# EAGLE design mayfly_platform_revb (EAGLE 7.7.0)
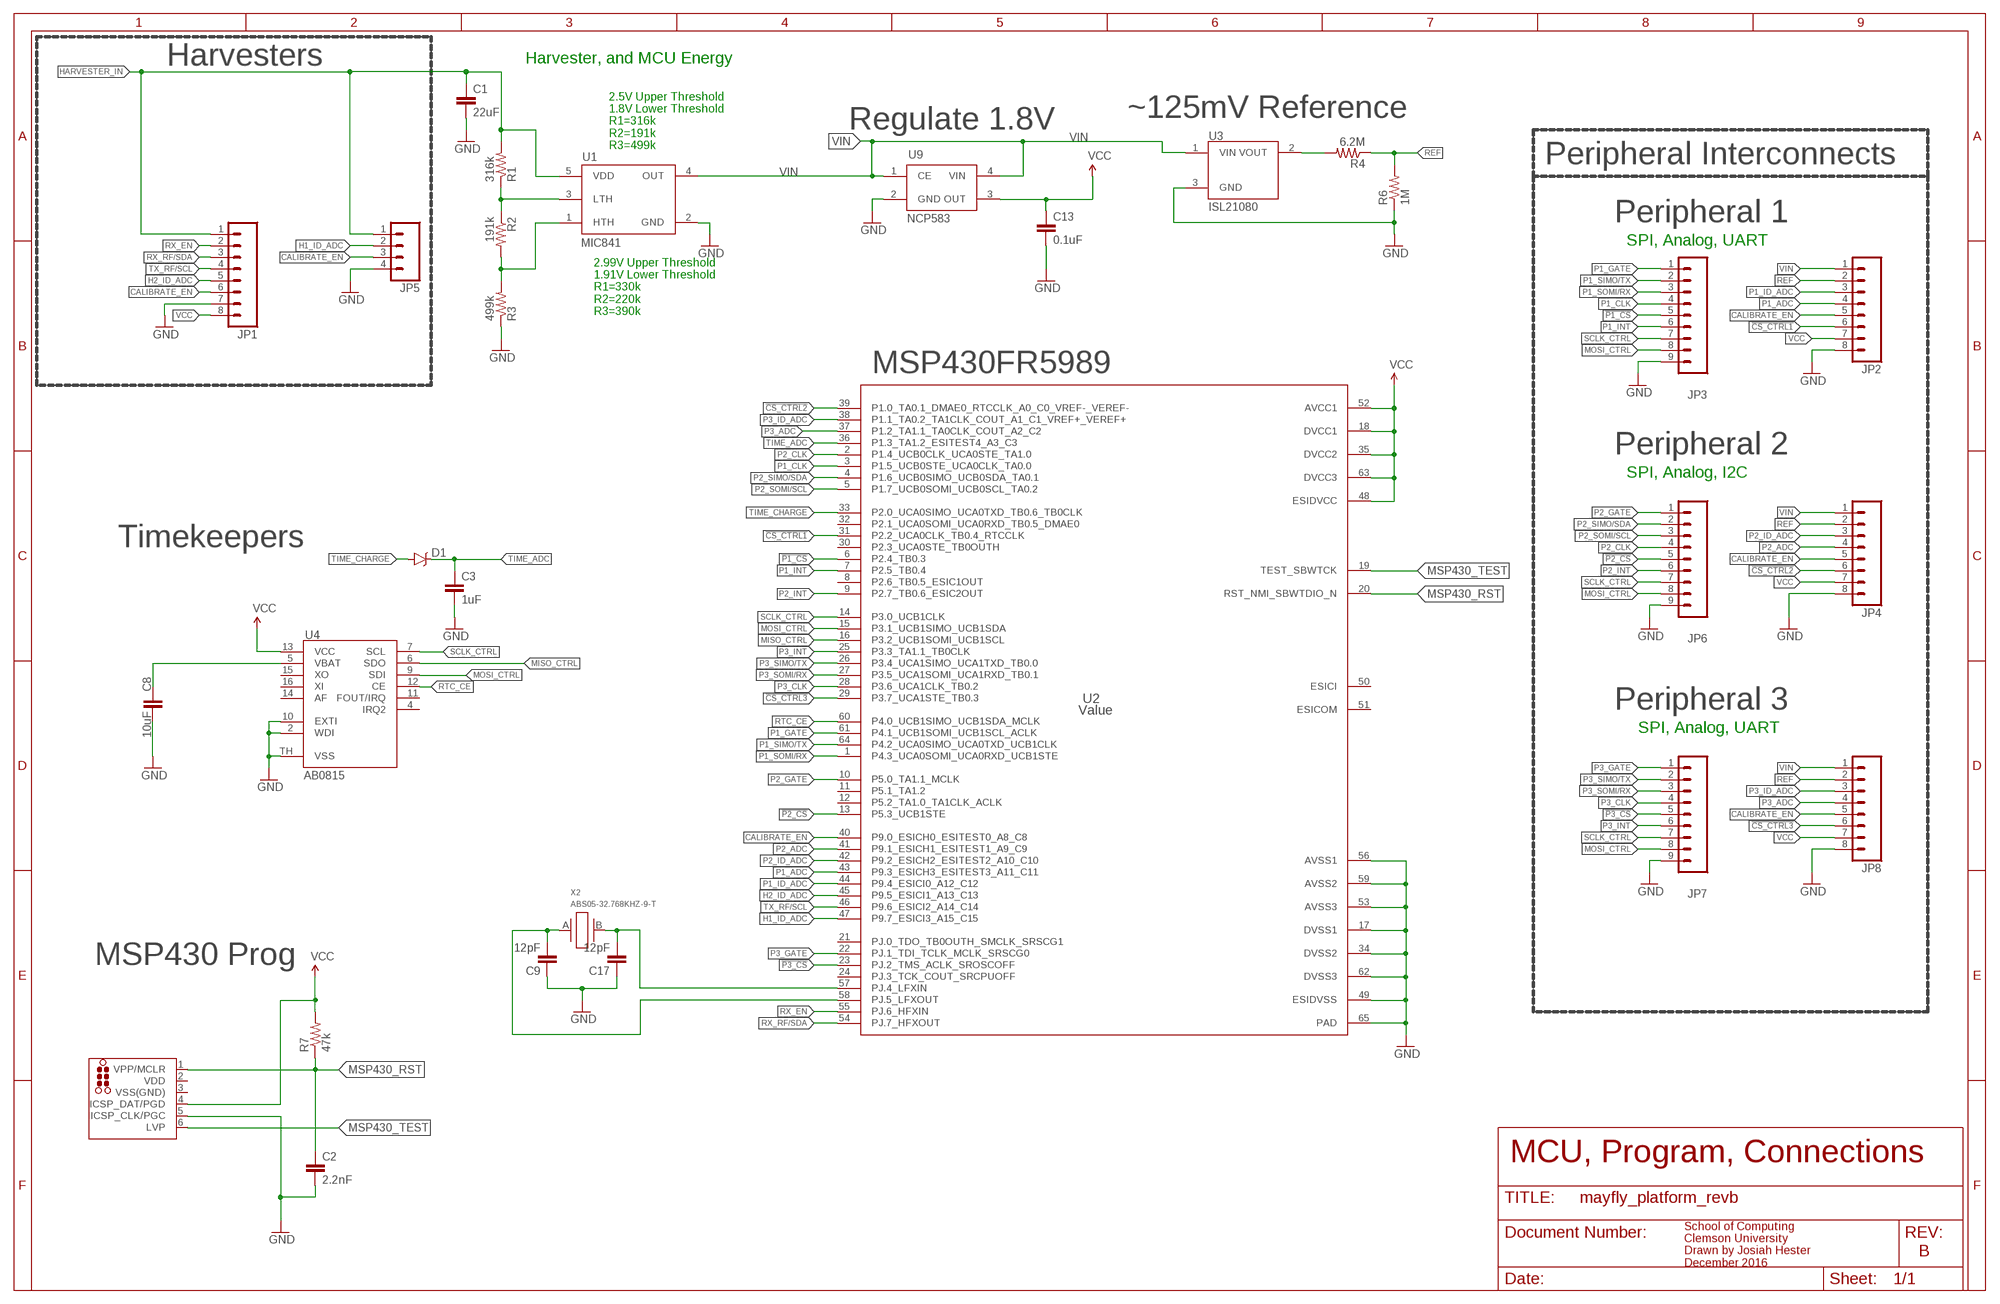
[diagram p0: schematic, sheet 1]

## Parts
C1  22uF  CAP1210  [1210]
C2  2.2nF  C-EU0603  [0603]
C3  1uF  C-EU0603  [0603]
C8  10uF  CAP0805  [0805]
C9  12pF  C-EU0603  [0603]
C13  0.1uF  C-EU0603  [0603]
C17  12pF  C-EU0603  [0603]
D1  RB751  DIODE-SCHOTTKY-RB751  [SOD-523]
J1  TC2030-MCP-NL  [TC2030-MCP-NL]
JP1  M081.27MM  [1X08-1.27MM]
JP2  M081.27MM  [1X08-1.27MM]
JP3  M091.27MM  [1X09-1.27MM]
JP4  M081.27MM  [1X08-1.27MM]
JP5  M041.27MM  [1X04-1.27MM]
JP6  M091.27MM  [1X09-1.27MM]
JP7  M091.27MM  [1X09-1.27MM]
JP8  M081.27MM  [1X08-1.27MM]
R1  316k  R-EU0603  [0603]
R2  191k  R-EU0603  [0603]
R3  499k  R-EU0603  [0603]
R4  6.2M  R-EU0603  [0603]
R6  1M  R-EU0603  [0603]
R7  47k  R-EU0603  [0603]
U1  MIC841  [SC70-5]
U2  Value  MSP430FR5989IRGCR  [RGC0064B]
U3  ISL21080  [SOT-23]
U4  AB0815  [QFN16]
U9  NCP583  [SC82-AB_1PRIMARY]
X2  ABS05-32.768KHZ-9-T  [ABS05]

## Nets
!CS_CTRL1: JP2.6 U2.31(P2.2_UCA0CLK_TB0.4_RTCCLK)
!CS_CTRL2: JP4.6 U2.39(P1.0_TA0.1_DMAE0_RTCCLK_A0_C0_VREF-_VEREF-)
!CS_CTRL3: JP8.6 U2.29(P3.7_UCA1STE_TB0.3)
!P1_CS: JP3.5 U2.6(P2.4_TB0.3)
!P2_CS: JP6.5 U2.13(P5.3_UCB1STE)
!P3_CS: JP7.5 U2.23(PJ.2_TMS_ACLK_SROSCOFF)
CALIBRATE_EN: JP1.6 JP2.5 JP4.5 JP5.3 JP8.5 U2.40(P9.0_ESICH0_ESITEST0_A8_C8)
GND: C1.2 C2.2 C3.2 C8.2 C9.1 C13.2 C17.1 J1.5(ICSP_CLK/PGC) JP1.7 JP2.8 JP3.9 JP4.8 JP5.4 JP6.9 JP7.9 JP8.8 R3.1 R6.1 U1.2(GND) U2.17(DVSS1) U2.34(DVSS2) U2.49(ESIDVSS) U2.53(AVSS3) U2.56(AVSS1) U2.59(AVSS2) U2.62(DVSS3) U2.65(PAD) U3.3(GND) U4.2(WDI) U4.10(EXTI) U4.TH(VSS) U9.2(GND)
H1_ID_ADC: JP5.2 U2.47(P9.7_ESICI3_A15_C15)
H2_ID_ADC: JP1.5 U2.45(P9.5_ESICI1_A13_C13)
HARVESTER_IN: C1.1 JP1.1 JP5.1 R1.2 U1.5(VDD)
MISO_CTRL: U2.16(P3.2_UCB1SOMI_UCB1SCL) U4.6(SDO)
MOSI_CTRL: JP3.8 JP6.8 JP7.8 U2.15(P3.1_UCB1SIMO_UCB1SDA) U4.9(SDI)
MSP430_RST: C2.1 J1.1(VPP/MCLR) R7.1 U2.20(RST_NMI_SBWTDIO_N)
MSP430_TEST: J1.6(LVP) U2.19(TEST_SBWTCK)
N$1: R1.1 R2.1 U1.3(LTH)
N$2: R4.2 U3.2(VOUT)
N$3: R2.2 R3.2 U1.1(HTH)
N$5: C17.2 U2.57(PJ.4_LFXIN) X2.B
N$6: C9.2 U2.58(PJ.5_LFXOUT) X2.A
N$8: C8.1 U4.5(VBAT)
P1_ADC: JP2.4 U2.43(P9.3_ESICH3_ESITEST3_A11_C11)
P1_CLK: JP3.4 U2.3(P1.5_UCB0STE_UCA0CLK_TA0.0)
P1_GATE: JP3.1 U2.61(P4.1_UCB1SOMI_UCB1SCL_ACLK)
P1_ID_ADC: JP2.3 U2.44(P9.4_ESICI0_A12_C12)
P1_INT: JP3.6 U2.7(P2.5_TB0.4)
P1_SIMO/TX: JP3.2 U2.64(P4.2_UCA0SIMO_UCA0TXD_UCB1CLK)
P1_SOMI/RX: JP3.3 U2.1(P4.3_UCA0SOMI_UCA0RXD_UCB1STE)
P2_ADC: JP4.4 U2.41(P9.1_ESICH1_ESITEST1_A9_C9)
P2_CLK: JP6.4 U2.2(P1.4_UCB0CLK_UCA0STE_TA1.0)
P2_GATE: JP6.1 U2.10(P5.0_TA1.1_MCLK)
P2_ID_ADC: JP4.3 U2.42(P9.2_ESICH2_ESITEST2_A10_C10)
P2_INT: JP6.6 U2.9(P2.7_TB0.6_ESIC2OUT)
P2_SIMO/SDA: JP6.2 U2.4(P1.6_UCB0SIMO_UCB0SDA_TA0.1)
P2_SOMI/SCL: JP6.3 U2.5(P1.7_UCB0SOMI_UCB0SCL_TA0.2)
P3_ADC: JP8.4 U2.37(P1.2_TA1.1_TA0CLK_COUT_A2_C2)
P3_CLK: JP7.4 U2.28(P3.6_UCA1CLK_TB0.2)
P3_GATE: JP7.1 U2.22(PJ.1_TDI_TCLK_MCLK_SRSCG0)
P3_ID_ADC: JP8.3 U2.38(P1.1_TA0.2_TA1CLK_COUT_A1_C1_VREF+_VEREF+)
P3_INT: JP7.6 U2.25(P3.3_TA1.1_TB0CLK)
P3_SIMO/TX: JP7.2 U2.26(P3.4_UCA1SIMO_UCA1TXD_TB0.0)
P3_SOMI/RX: JP7.3 U2.27(P3.5_UCA1SOMI_UCA1RXD_TB0.1)
REF: JP2.2 JP4.2 JP8.2 R4.1 R6.2
RTC_CE: U2.60(P4.0_UCB1SIMO_UCB1SDA_MCLK) U4.12(CE)
RX_EN: JP1.2 U2.55(PJ.6_HFXIN)
RX_RF/SDA: JP1.3 U2.54(PJ.7_HFXOUT)
SCLK_CTRL: JP3.7 JP6.7 JP7.7 U2.14(P3.0_UCB1CLK) U4.7(SCL)
TIME_ADC: C3.1 D1.C U2.36(P1.3_TA1.2_ESITEST4_A3_C3)
TIME_CHARGE: D1.A U2.33(P2.0_UCA0SIMO_UCA0TXD_TB0.6_TB0CLK)
TX_RF/SCL: JP1.4 U2.46(P9.6_ESICI2_A14_C14)
VCC: C13.1 J1.4(ICSP_DAT/PGD) JP1.8 JP2.7 JP4.7 JP8.7 R7.2 U2.18(DVCC1) U2.35(DVCC2) U2.48(ESIDVCC) U2.52(AVCC1) U2.63(DVCC3) U4.13(VCC) U9.3(OUT)
VIN: JP2.1 JP4.1 JP8.1 U1.4(OUT) U3.1(VIN) U9.1(CE) U9.4(VIN)
Unconnected: U2.8(P2.6_TB0.5_ESIC1OUT) U2.11(P5.1_TA1.2) U2.12(P5.2_TA1.0_TA1CLK_ACLK) U2.21(PJ.0_TDO_TB0OUTH_SMCLK_SRSCG1) U2.24(PJ.3_TCK_COUT_SRCPUOFF) U2.30(P2.3_UCA0STE_TB0OUTH) U2.32(P2.1_UCA0SOMI_UCA0RXD_TB0.5_DMAE0) U2.50(ESICI) U2.51(ESICOM) U4.4(IRQ2) U4.11(FOUT/IRQ) U4.14(AF) U4.15(XO) U4.16(XI)

## Notes on the sheet
- Harvesters | Harvester, and MCU Energy
- ~125mV Reference
- Regulate 1.8V
- 2.5V Upper Threshold
  1.8V Lower Threshold
  R1=316k
  R2=191k
  R3=499k
- Peripheral Interconnects
- Peripheral 1
- SPI, Analog, UART
- 2.99V Upper Threshold
  1.91V Lower Threshold
  R1=330k
  R2=220k
  R3=390k
- MSP430FR5989
- Peripheral 2
- SPI, Analog, I2C
- Timekeepers
- Peripheral 3
- SPI, Analog, UART
- MSP430 Prog
- MCU, Program, Connections
- B
- School of Computing
  Clemson University
  Drawn by Josiah Hester
  December 2016

## Power pins joined to a net without a drawn wire
VDD: J1.2(VDD)
VSS(GND): J1.3(VSS(GND))

## Library data of the parts
C1 = SparkFun-Capacitors:CAP: Capacitor Standard 0603 ceramic capacitor, and 0.1" leaded capacitor.; MANUFACTURERPARTNUMBER: CL32A226KAJNNNE; MPN: CL32A226KAJNNNE
C2 = tiny_passives:C-EU; MPN: 06035C222KAT2A
C3 = tiny_passives:C-EU; MANUFACTURERPARTNUMBER: 0603YD105KAT2A; MPN: 0603YD105KAT2A
C8 = SparkFun-Capacitors:CAP: Capacitor Standard 0603 ceramic capacitor, and 0.1" leaded capacitor.; MPN: 0805YD106KAT2A
C9 C17 = tiny_passives:C-EU; MPN: CL10C120JB8NNNC
C13 = tiny_passives:C-EU; MANUFACTURERPARTNUMBER: 0603YC104KAT2A; MPN: 0603YC104KAT2A
D1 = SparkFun-DiscreteSemi:DIODE-SCHOTTKY: Schottky diodes in SFE's production catalog BAT20J 1A 23V 0.62Vf RB751 120mA 40V 0.37Vf PMEG4005EJ 0.5A 40V 0.42Vf MBRA140 1A 40V 0.5Vf B340A 3A 40V SMA; DIGIKEY: BAS40-02V-V-G-08GICT-ND; MPN: BAS40-02V-V-G-08; PROD_ID: DIO-11018
J1 = tag-connect_msp430:TC2030: TAG-CONNECT ICSP Connector Manufacturer: Tag-Connect <http://www.tag-connect.com> Cable for easy In-Circuit Serial Programming. Designed for Microchip ICD2, suitable for many others. Two variants - one "with legs" (for hands-free fit on PCB) and another "without legs" for quick programming. PAD Description 1 MCLR/Vpp 2 Vdd 3 GND 4 PGD (ISPDAT) 5 PGC (ISPCLK) 6 nc (used for LVP) ©2009 ROFA.cz - modified and updated by Robert Darlington ‹rdarlington@gmail.com›
JP1 = SparkFun-Connectors:M08: Header 8 Standard 8-pin 0.1" header. Use with straight break away headers (SKU : PRT-00116), right angle break away headers (PRT-00553), swiss pins (PRT-00743), machine pins (PRT-00117), and female headers (PRT-00115).; DIGIKEY: ED90570-ND; MANUFACTURERPARTNUMBER: 851-43-008-10-001000; MPN: 851-43-008-10-001000
JP2 JP4 JP8 = SparkFun-Connectors:M08: Header 8 Standard 8-pin 0.1" header. Use with straight break away headers (SKU : PRT-00116), right angle break away headers (PRT-00553), swiss pins (PRT-00743), machine pins (PRT-00117), and female headers (PRT-00115).; DIGIKEY: ED90570-ND; MPN: 851-43-008-10-001000
JP3 JP6 JP7 = SparkFun-Connectors:M09: Header 9 Standard 9-pin 0.1" header. Use with straight break away headers (SKU : PRT-00116), right angle break away headers (PRT-00553), swiss pins (PRT-00743), machine pins (PRT-00117), and female headers (PRT-00115).; DIGIKEY: 1212-1354-ND; MPN: 851-87-009-10-001101
JP5 = SparkFun-Connectors:M04: Header 4 Standard 4-pin 0.1" header. Use with straight break away headers (SKU : PRT-00116), right angle break away headers (PRT-00553), swiss pins (PRT-00743), machine pins (PRT-00117), and female headers (PRT-00115). Molex polarized connector foot print use with SKU : PRT-08231 with associated crimp pins and housings. 1MM SMD Version SKU: PRT-10208; DIGIKEY: ED90528-ND; MANUFACTURERPARTNUMBER: 851-43-004-10-001000; MPN: 851-43-004-10-001000
R1 = tiny_passives:R-EU; DIGIKEY: 311-316KHRCT-ND; MANUFACTURERPARTNUMBER: RC0603FR-07316KL; MPN: RC0603FR-07316KL
R2 = tiny_passives:R-EU; DIGIKEY: 311-191KHRCT-ND; MANUFACTURERPARTNUMBER: RC0603FR-07191KL; MPN: RC0603FR-07191KL
R3 = tiny_passives:R-EU; DIGIKEY: 311-499KHRCT-ND; MANUFACTURERPARTNUMBER: RC0603FR-07499KL; MPN: RC0603FR-07499KL
R4 = tiny_passives:R-EU; DIGIKEY: 541-6.20MHCT-ND; MPN: CRCW06036M20FKEA
R6 = tiny_passives:R-EU; DIGIKEY: 311-1.00MHRCT-ND; MPN: RC0603FR-071ML
R7 = tiny_passives:R-EU; MPN: CRCW060347K0JNEA
U1 = fedpower:MIC841: MIC841:Comparator with reference and adj. hysteresis; DIGIKEY: 576-2923-1-ND; MPN: MIC841HYC5-TR
U2 = msp430fr5989:MSP430FR5989IRGCR; ALTERNATEPARTNUMBER: MSP430FR5989IRGCT; COMPTYPE: IC; DIGIKEY: 296-42031-1-ND; MANUFACTURER: Texas Instruments; MOUNTTYPE: SMT; MPN: MSP430FR59891IRGCT; PACKAGEREFERENCE: RGC0064B; PARTNUMBER: MSP430FR5989IRGCR; PIN_COUNT: 65; REFDES: RefDes; ROHS: Y; TYPE: TYPE
U3 = isl21080:ISL21080: Intersil: ISL21080, 300nA NanoPower Voltage References The ISL21080 analog voltage references feature low supply voltage operation at ultra-low 310nA typ, 1.5µA max operating current. Additionally, the ISL21080 family features guaranteed initial accuracy as low as ±0.2% and 50ppm/°C temperature coefficient. These references are ideal for general purpose portable applications to extend battery life at lower cost. The ISL21080 is provided in the industry standard 3 Ld SOT-23 pinout. The ISL21080 output voltages can be used as precision voltage sources for voltage monitors, control loops, standby voltages for low power states for DSP, FPGA, Datapath Controllers, microcontrollers and other core voltages: 0.9V, 1.024V, 1.25V, 1.5V, 2.048V, 2.5V, 3.0V, 3.3V, 4.096V and 5.0V. Special Note: Post-assembly x-ray inspection may lead to permanent changes in device output voltage and should be minimized or avoided. For further information, please see “Applications Information” on page 14 and AN1533, “X-Ray Effects on Intersil FGA References”.; DIGIKEY: ISL21080DIH309Z-TKCT-ND; MPN: ISL21080DIH309Z-TK
U4 = AB08XX:AB0815: AB08X5 Real-Time Clock Family: SPI The ABRACON AB08X5 Real-Time Clock family provides a groundbreaking combination of ultra-low power coupled with a highly sophisticated feature set. With power requirements significantly lower than any other industry RTC (as low as 14 nA), these are the first semiconductors based on innovative SPOTTM (Subthreshold Power Optimized Technology) CMOS platform. The AB08X5 includes on-chip oscillators to provide minimum power consumption, full RTC functions including battery backup and programmable counters and alarms for timer and watchdog functions, and either an I2C or SPI serial interface for communication with a host controller.; DIGIKEY: 535-11930-1-ND; MPN: AB0815-T3
U9 = ncp583:NCP583: NCP583 - Ultra-Low Iq 150 mA CMOS LDO Regulator with Enable The NCP583 series of low dropout regulators are designed for portable battery powered applications which require precise output voltage accuracy and low quiescent current. These devices feature an enable function which lowers current consumption significantly and are offered in two small packages; SC−82AB and the SOT−563. A 1.0 mF ceramic capacitor is the recommended value to be used with these devices on the output pin.; DIGIKEY: NCP583SQ18T1GOSCT-ND; MPN: NCP583SQ18T1G
X2 = abs05:ABS05-32.768KHZ: 32.768kHz Crystal; DIGIKEY: 535-11897-1-ND; MPN: ABS05-32.768KHZ-9-T

## Board
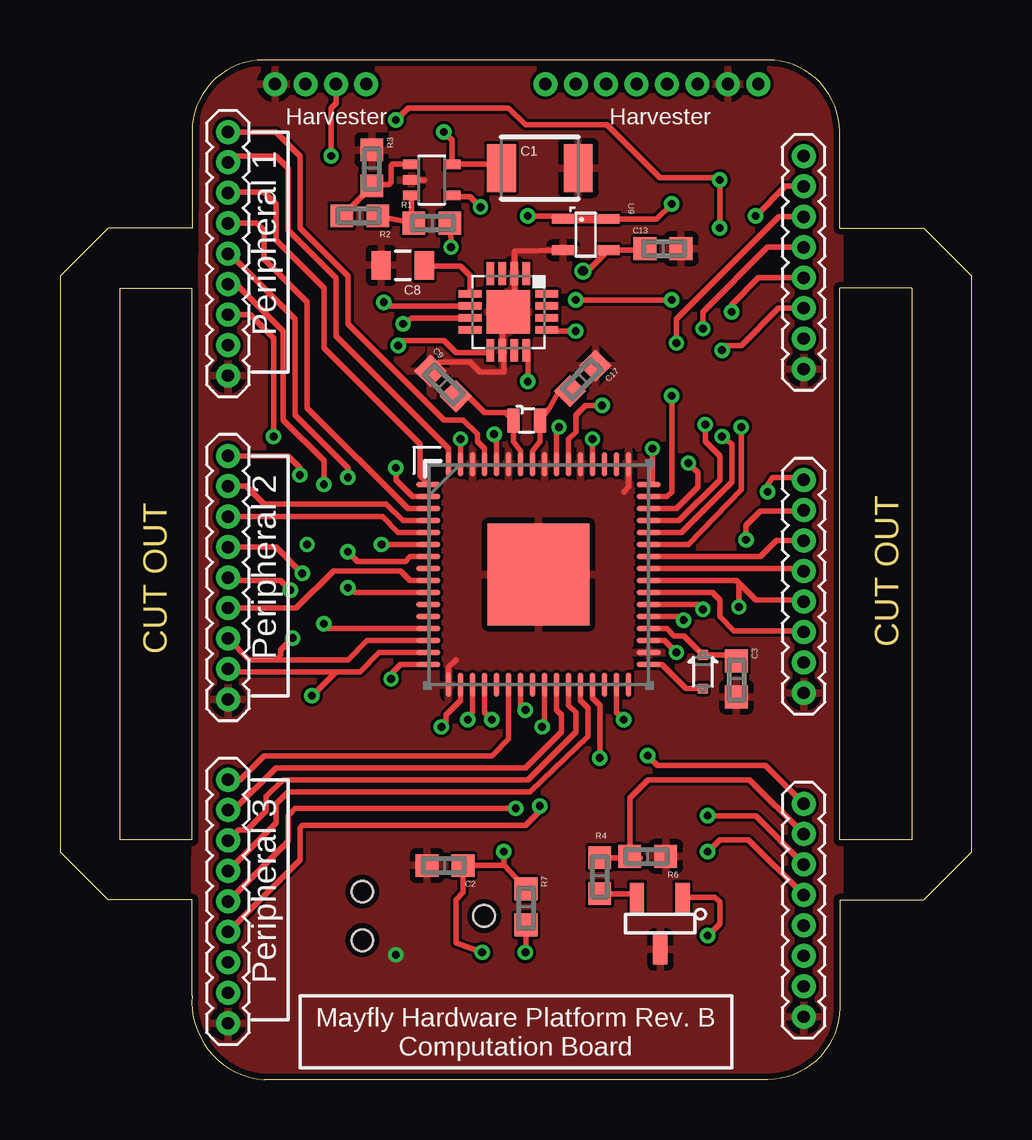
[diagram p1: board, top side]
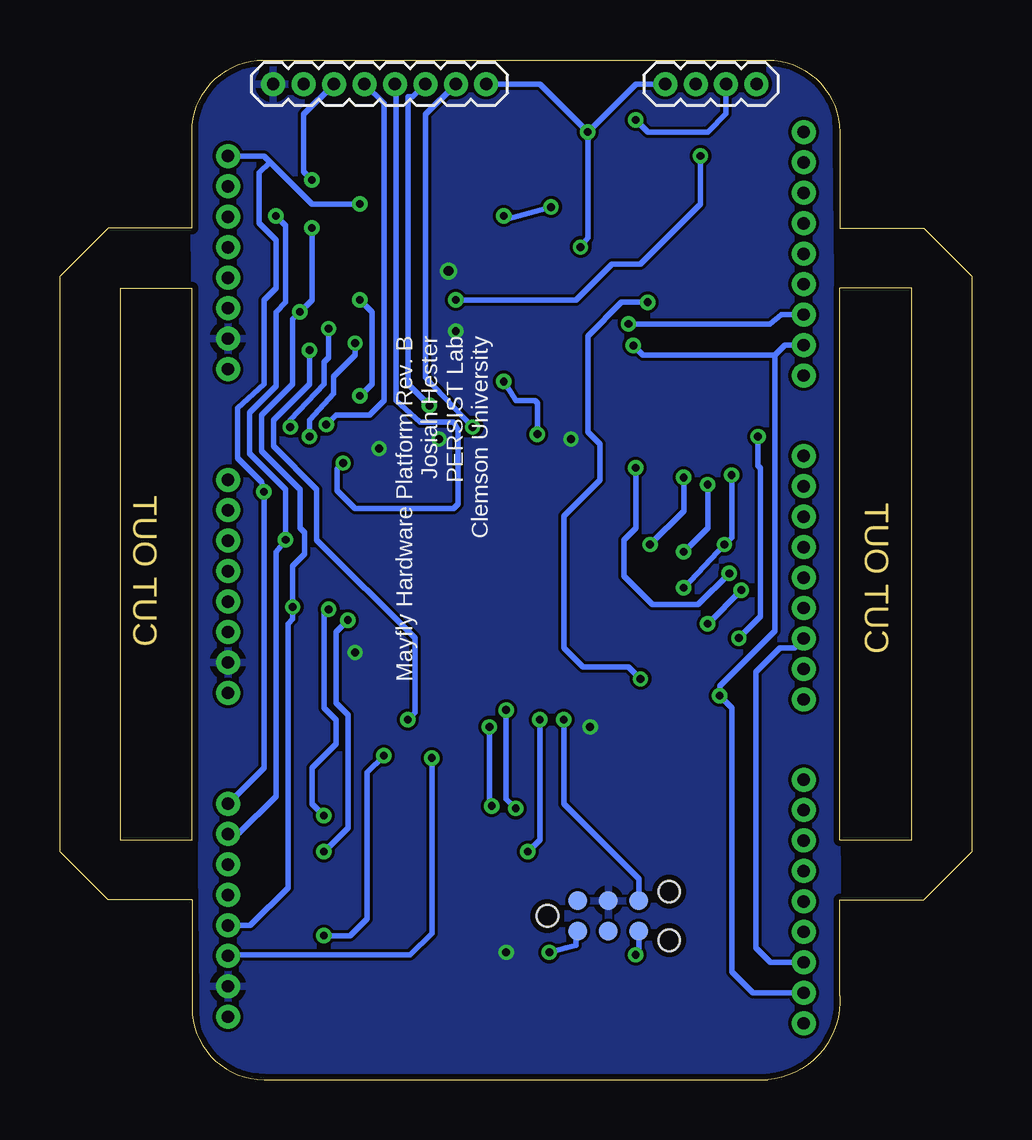
[diagram p2: board, bottom side, seen from below]

Size 38 x 42.5 mm. Coordinates in mm from the lower left corner, seen from the top.
Outline: 29.5,42.5 11.5,42.5 8.5,42.5 arc90 5.5,39.5 5.5,35.5 2,35.5 0,33.5 0,9.5 2,7.5 5.5,7.5 5.5,3.5 arc90 8.5,0 29.5,0 arc90 32.5,3 32.5,7.5 36,7.5 38,9.5 38,33.5 36,35.5 32.5,35.5 32.5,39.5 arc90 29.5,42.5
Outline: 2.5,10 2.5,33 5.5,33 5.5,10 2.5,10
Outline: 35.5,33 35.5,10 32.5,10 32.5,33 35.5,33
Copper layers (1*16): Top 0.035mm / dielectric 1.5mm / Bottom 0.035mm
Design rules "MF_Standard_2_Layer": minimum track width 5mil, minimum drill 12mil, track to track 5mil, track to pad 5mil, pad to pad 5mil, via to via 5mil, smd to smd 0mil, copper to edge 10mil, drill to drill 10mil, minimum pad ring 6mil, minimum via ring 6mil, stop-mask expansion 2mil, vias tented up to drill 25mil, thermal gap 10mil

### Footprints (pad centres in the part's own frame; a part is rotated, then mirrored left to right if it is on the bottom)
1210 = smd 1.2 x 2: 1 -1.6,0; 2 1.6,0
0603 = smd 0.95 x 0.95: 1 -0.75,0; 2 0.75,0
0805 = smd 0.8 x 1.2: 1 -0.9,0; 2 0.9,0
SOD-523 = smd 0.4 x 0.4: A -0.7,0; C 0.7,0
TC2030-MCP-NL = smd 0.787 x 0.787: 1 1.27,-0.635; 2 1.27,0.635; 3 2.54,-0.635; 4 2.54,0.635; 5 3.81,-0.635; 6 3.81,0.635 | hole 0.889: 0,0; 5.08,-1.016; 5.08,1.016
1X08-1.27MM = drill 0.508 pad 1: 1 0,0; 2 1.27,0; 3 2.54,0; 4 3.81,0; 5 5.08,0; 6 6.35,0; 7 7.62,0; 8 8.89,0
1X09-1.27MM = drill 0.508 pad 1: 1 0,0; 2 1.27,0; 3 2.54,0; 4 3.81,0; 5 5.08,0; 6 6.35,0; 7 7.62,0; 8 8.89,0; 9 10.16,0
1X04-1.27MM = drill 0.508 pad 1: 1 0,0; 2 1.27,0; 3 2.54,0; 4 3.81,0
SC70-5 = smd 0.4 x 0.7: 1 -0.65,-0.85; 2 0,-0.85; 3 0.65,-0.85; 4 0.65,0.85; 5 -0.65,0.85
RGC0064B = smd 1 x 0.23: 1 -4.6,3.75; 2 -4.6,3.25; 3 -4.6,2.75; 4 -4.6,2.25; 5 -4.6,1.75; 6 -4.6,1.25; 7 -4.6,0.75; 8 -4.6,0.25; 9 -4.6,-0.25; 10 -4.6,-0.75; 11 -4.6,-1.25; 12 -4.6,-1.75; 13 -4.6,-2.25; 14 -4.6,-2.75; 15 -4.6,-3.25; 16 -4.6,-3.75; 33 4.6,-3.75; 34 4.6,-3.25; 35 4.6,-2.75; 36 4.6,-2.25; 37 4.6,-1.75; 38 4.6,-1.25; 39 4.6,-0.75; 40 4.6,-0.25; 41 4.6,0.25; 42 4.6,0.75; 43 4.6,1.25; 44 4.6,1.75; 45 4.6,2.25; 46 4.6,2.75; 47 4.6,3.25; 48 4.6,3.75 | smd 0.23 x 1: 17 -3.751,-4.6; 18 -3.251,-4.6; 19 -2.751,-4.6; 20 -2.251,-4.6; 21 -1.75,-4.6; 22 -1.25,-4.6; 23 -0.75,-4.6; 24 -0.25,-4.6; 25 0.25,-4.6; 26 0.75,-4.6; 27 1.25,-4.6; 28 1.75,-4.6; 29 2.251,-4.6; 30 2.751,-4.6; 31 3.251,-4.6; 32 3.751,-4.6; 49 3.751,4.6; 50 3.251,4.6; 51 2.751,4.6; 52 2.251,4.6; 53 1.75,4.6; 54 1.25,4.6; 55 0.75,4.6; 56 0.25,4.6; 57 -0.25,4.6; 58 -0.75,4.6; 59 -1.25,4.6; 60 -1.75,4.6; 61 -2.251,4.6; 62 -2.751,4.6; 63 -3.251,4.6; 64 -3.751,4.6 | smd 4.242 x 4.242: 65 0,0
SOT-23 = smd 0.6 x 1.25: 1 -0.95,-1.075; 2 0.95,-1.075; 3 -0.025,1.075
QFN16 = smd 0.95 x 0.3: 1 -1.6,0.75; 2 -1.6,0.25; 3 -1.6,-0.25; 4 -1.6,-0.75; 9 1.6,-0.75; 10 1.6,-0.25; 11 1.6,0.25; 12 1.6,0.75 | smd 0.3 x 0.95: 5 -0.75,-1.6; 6 -0.25,-1.6; 7 0.25,-1.6; 8 0.75,-1.6; 13 0.75,1.6; 14 0.25,1.6; 15 -0.25,1.6; 16 -0.75,1.6 | smd 1.8 x 1.8: TH 0,0
SC82-AB_1PRIMARY = smd 0.406 x 0.914: 1 -0.621,-0.913; 2 0.675,-0.913; 3 0.675,0.967; 4 -0.621,0.967
ABS05 = smd 0.5 x 1: A -0.55,0; B 0.55,0

### Placement (x,y rotation side)
C1  20,38 0 top
C2  16.05,8.92 180 top
C3  28.2,16.7 270 top
C8  14.29,33.94 180 top
C9  15.97,29.01 315 top
C13  25.14,34.63 0 top
C17  21.79,29.23 225 top
D1  26.8,17 90 top
J1  17.68,6.82 0 bottom
JP1  20.23,41.5 180 bottom
JP2  31,38.5 270 top
JP3  7,39.5 270 top
JP4  31,25 270 top
JP5  12.77,41.5 0 bottom
JP6  7,26 270 top
JP7  7,12.5 270 top
JP8  31,11.5 270 top
R1  15.5,35.7 0 top
R2  12.5,36 180 top
R3  13,38 270 top
R4  22.5,8.5 270 top
R6  24.5,9.3 180 top
R7  19.43,7.2 270 top
U1  15.5,37.5 270 top
U2  19.95,21.05 0 top
U3  25,6.5 180 top
U4  18.69,32 270 top
U9  21.89,35.25 270 top
X2  19.45,27.47 0 top

### Tracks (layer width: path | path; a pad name or v marks a point on that pad's centre or on a via)
!CS_CTRL1  (via drill 0.33)
  Top 0.222: JP2.6 29.95,32.15 28.4,30.6 27.8,30.6 v27.6,30.4 | v23.5,15 23.2,15.3 U2.31
  Bottom 0.222: v27.6,30.4 27.6,29 29.1,27.5 29.1,26.4 27.3,24.6 27.3,22.5 23.2,18.4 23.2,15.3 v23.5,15
!CS_CTRL2
  Top 0.222: U2.39 27.2,20.3 27.5,20 27.5,19.3 28.1,18.7 30.95,18.7 JP4.6
!CS_CTRL3  (via drill 0.33)
  Top 0.222: U2.29 22.2,15.9 22.5,15.6 v22.5,13.4
  Bottom 0.222: v22.5,13.4 22.5,6.1 23.4,5.2 30.95,5.2 JP8.6
!P1_CS  (via drill 0.33)
  Top 0.222: v12,25.1 12,25.5 9.8,27.7 9.8,31.7 7.08,34.42 JP3.5 | v13.4,22.3 U2.6 | U2.6
  Bottom 0.222: v12,25.1 12,23.7 v13.4,22.3
!P2_CS  (via drill 0.33)
  Top 0.222: U2.13 11.2,18.8 v11,19 | v9.6,20.4 9.2,20.8 7.12,20.8 JP6.5
  Bottom 0.222: v11,19 v9.6,20.4
!P3_CS  (via drill 0.33)
  Top 0.222: U2.23 19.2,15.6 v19.4,15.4 | v19,11.3 9.8,11.3 9.5,11 9.5,9.92 JP7.5
  Bottom 0.222: v19.4,15.4 19.4,11.7 v19,11.3
CALIBRATE_EN  (via drill 0.33)
  Top 0.222: JP4.5 30.92,20 29,20 28.3,20.7 | v28,32 28,32.3 29.12,33.42 JP2.5 | U2.40 28.2,20.8 28.3,20.7 | 28.3,20.7 v28.3,19.7 | v27.5,35.5 v27.5,37.5 27.4,37.6 25,37.6 22.8,39.8 19.4,39.8 18.7,40.5 14.5,40.5 v14,40
  Bottom 0.22: 27.85,37.85 27.85,40.23
  Bottom 0.222: JP8.5 30.08,6.42 28.5,8 28.5,19 28.3,19.2 v28.3,19.7 28.3,21.4 27.8,21.9 27.8,22.8 28,23 28,24.6 29.6,26.2 29.6,27.7 28.3,29 28.3,31.7 v28,32 27.5,32.5 v27.5,35.5 | 27.85,37.85 v27.5,37.5 | v14,40 13.5,39.5 11,39.5 10.23,40.27 JP5.3 | 27.85,40.23 JP1.6
GND  (via drill 0.33)
  Top 0.222: U9.2 18.94,34.54 U4.2 18.94,32.25 U4.TH 18.44,31.75 U4.10 18.5,30.34 18.5,29.5 17.5,29.5 17.1,29.9 15.8,29.9 C9.1 | U1.2 15.2,37.5 | v14,5.2 14,5 | U2.17 16.2,17.2 16.5,17.5 | U2.49 23.7,24.7 23.5,24.5
  Bottom 0.222: J1.5 13.87,5.33 v14,5.2
  pour Top: 5.5,-0.5 32.5,-0.5 32.5,42.5 6,42.5
H1_ID_ADC  (via drill 0.33)
  Top 0.222: U2.47 25.3,24.3 25.5,24.5 v25.5,28.5 | v25.5,32.5 v21.5,32.5 | v11.3,38.5 11.3,40.5 11.5,40.7 JP5.2
  Bottom 0.222: v21.5,32.5 16.5,32.5 15,34 13.8,34 11.3,36.5 v11.3,38.5 | v25.5,32.5 25,32 25,29 v25.5,28.5
H2_ID_ADC  (via drill 0.33)
  Top 0.222: U2.45 25.8,23.3 27.5,25 27.5,26 26.9,26.6 v26.9,27.3
  Bottom 0.22: 24.5,38.6 24.5,40.69
  Bottom 0.222: 24.5,38.6 24.5,28.3 25.1,27.7 26.5,27.7 v26.9,27.3 | 24.5,40.69 JP1.5
HARVESTER_IN  (via drill 0.33)
  Top 0.222: v16.3,34.7 16.3,34.95 R1.2 | C1.1 18.25,38.15 U1.5 16.35,39.15 v16,39.5
  Bottom 0.222: v16,39.5 16,35.1 v16.3,34.7 | v16,39.5 14,41.5 JP5.1 | v16,39.5 18,41.5 JP1.1
MISO_CTRL  (via drill 0.33)
  Top 0.222: U4.6 13.65,32.25 v13.5,32.4 | v13.8,16.7 13.8,16.9 14.2,17.3 U2.16 | U2.16
  Bottom 0.222: v13.5,32.4 14.6,32.4 16,31 16,27 15.5,26.5 15.5,25 17,23.5 17,18 16.2,17.2 14.3,17.2 v13.8,16.7
MOSI_CTRL  (via drill 0.33)
  Top 0.222: U2.15 13.3,17.8 12.5,17 11.5,17 | 11.5,17 7.11,17 JP6.8 | v10.5,16 11.5,17 | v14.1,30.6 14.3,30.8 16,30.8 16.5,30.3 17.84,30.3 U4.9
  Bottom 0.222: JP7.8 9.11,3.61 10,4.5 10,15.5 v10.5,16 | JP3.8 7.79,30.61 8.2,30.2 | 8.2,30.2 8.2,18.7 10.5,16.4 v10.5,16 | 10.6,16.1 v10.5,16 | 8.2,30.2 13.7,30.2 v14.1,30.6
MSP430_RST  (via drill 0.33)
  Top 0.222: 18.54,8.92 C2.1 16.8,7.8 16.5,7.5 16.5,5.7 v17.6,5.3 | 18.54,8.92 R7.1 | U2.20 17.7,15.3 v18,15 | v18.5,9.5 18.5,8.96 18.54,8.92
  Bottom 0.222: v17.6,5.3 16.9,5.5 16.5,5.6 16.5,6.09 J1.1 | v18,15 18,10 v18.5,9.5
MSP430_TEST  (via drill 0.33)
  Top 0.222: U2.19 17.2,15.3 v17,15
  Bottom 0.222: J1.6 13.87,8.37 17,11.5 v17,15
N$1
  Top 0.222: R2.1 R1.1 14.65,35.8 U1.3
N$2
  Top 0.222: R4.2 23.88,7.75 U3.2
N$3
  Top 0.222: R2.2 R3.2 13.05,37.3 13.7,37.3 13.8,37.4 13.8,38.1 13.85,38.15 U1.1
N$5
  Top 0.222: U2.57 19.7,26.2 20,26.6 X2.B 20.4,28 20.8,28.7 21.16,28.9 C17.2 | U2.57
N$6
  Top 0.222: U2.58 19.2,26.2 18.9,26.6 X2.A 18.57,27.8 17.7,27.8 16.72,28.78 C9.2
N$8
  Top 0.222: U4.5 17.09,33.51 16.7,33.9 15.23,33.9 C8.1
P1_ADC  (via drill 0.33)
  Top 0.222: U2.43 26.2,22.3 28.4,24.6 v28.4,27.2 | U2.43 | v26.8,31.3 26.8,32 29.49,34.69 JP2.4
  Bottom 0.222: v28.4,27.2 28.4,27.5 27,29 27,29.9 26.8,30.1 v26.8,31.3
P1_CLK
  Top 0.222: U2.3 14.5,23.8 10.3,28 10.3,32.4 8.5,34.2 8.5,35.4 8.2,35.7 JP3.4 | U2.3
P1_GATE
  Top 0.222: JP3.1 9,39.5 10,38.5 10,35.5 12,33.5 12,31.5 16,27.5 16.8,27.5 17.4,26.9 17.4,26.6 17.7,26.3 U2.61
P1_ID_ADC  (via drill 0.33)
  Top 0.222: U2.44 25.9,22.8 28,24.9 28,26.5 v27.6,26.8 | v25.7,30.7 25.7,31.7 29.96,35.96 JP2.3
  Bottom 0.222: v25.7,30.7 25.7,30.2 26.6,29.3 26.6,28.6 27.6,27.5 v27.6,26.8
P1_INT  (via drill 0.33)
  Top 0.222: v11,24.8 11,25.8 9.3,27.5 9.3,31.2 7.35,33.15 JP3.6 | v12,22 12.4,21.6 14.4,21.6 14.6,21.8 U2.7 | U2.7
  Bottom 0.222: v11,24.8 11,23 v12,22
P1_SIMO/TX
  Top 0.222: U2.64 16.2,26.3 11.5,31 11.5,33.4 9.5,35.4 9.5,38 9,38.5 7.27,38.5 JP3.2
P1_SOMI/RX
  Top 0.222: U2.1 15,25.15 15,26.5 11,30.5 11,33 9,35 9,36.5 8.5,37 7.04,37 JP3.3
P2_ADC
  Top 0.222: U2.41 30.89,21.3 JP4.4
P2_CLK  (via drill 0.33)
  Top 0.222: U2.2 14.7,24.3 14,25 v14,25.5 | v10.1,21.1 9,22.2 JP6.4
  Bottom 0.222: v14,25.5 14,23 14.5,22.5 14.5,21 13.3,19.8 11.4,19.8 v10.1,21.1
P2_GATE  (via drill 0.33)
  Top 0.222: JP6.1 9.5,26 10,25.5 v10,25.2 | U2.10 | U2.10 12.3,20.3 v12,20.5
  Bottom 0.222: v10,25.2 10,22.6 v10.3,22.3 v12,20.5
P2_ID_ADC
  Top 0.222: JP4.3 29.86,22.46 29.2,21.8 U2.42 | U2.42
P2_INT
  Top 0.222: JP6.6 9.85,19.65 11.4,21.2 14.2,21.2 14.6,20.8 U2.9 | U2.9
P2_SIMO/SDA
  Top 0.222: U2.4 14.3,23.3 13.6,24 8.5,24 7.77,24.73 JP6.2 | U2.4
P2_SOMI/SCL
  Top 0.222: JP6.3 13.44,23.46 14.1,22.8 U2.5 | U2.5
P3_ADC  (via drill 0.33)
  Top 0.222: v27,9.5 27.5,10 28.69,10 JP8.4 | U2.37 25.85,19.3 v26,19.15 | U2.37
  Bottom 0.222: v27,9.5 26,10.5 26,15.2 26.5,15.7 26.5,18.65 v26,19.15
P3_CLK
  Top 0.222: U2.28 21.7,15.8 22,15.5 22,14.3 19.6,12 9.5,12 9,11.5 9,10.69 JP7.4
P3_GATE
  Top 0.222: U2.22 18.7,14.2 18,13.5 8.5,13.5 7.5,12.5 JP7.1 | U2.22
P3_ID_ADC  (via drill 0.33)
  Top 0.222: U2.38 26.6,19.8 v26.8,19.6 | v27,11 29,11 30,10 30,9.96 JP8.3
  Bottom 0.222: v27,11 27.5,11.5 27.5,13 26.5,14 26.5,15 27,15.5 27,19.4 v26.8,19.6
P3_INT  (via drill 0.33)
  Top 0.222: U2.25 20.2,14.9 v20.1,14.7 | v20,11.4 20,11.2 19.4,10.6 10.1,10.6 10,10.5 10,9.15 JP7.6
  Bottom 0.222: v20.1,14.7 20.1,11.6 v20,11.4
P3_SIMO/TX
  Top 0.222: U2.26 | U2.26 20.7,15.4 20.9,15.2 20.9,14.5 19.4,13 9,13 7.23,11.23 JP7.2
P3_SOMI/RX
  Top 0.222: U2.27 21.2,15.6 21.5,15.3 21.5,14.5 19.5,12.5 9.3,12.5 8.6,11.8 8.6,11.2 7.8,10.4 7.44,10.4 JP7.3 | U2.27
REF  (via drill 0.33)
  Top 0.222: v28.6,22.5 28.6,23.1 29.2,23.7 30.97,23.7 JP4.2 | R4.1 24.2,9.25 R6.2 23.75,11.75 24.5,12.5 28.73,12.5 JP8.2 | JP2.2 30.23,37.23 v29,36
  Bottom 0.222: v29,36 28.6,35.6 28.6,32.4 29,32 29,28.9 30.1,27.8 30.1,26.1 28.6,24.6 v28.6,22.5 29,22 29,11.8 30.57,10.23 JP8.2
RTC_CE  (via drill 0.33)
  Top 0.222: U2.60 18.2,26.8 v18.1,26.9 | v19.5,29.1 19.5,30.34 U4.12
  Bottom 0.222: v18.1,26.9 18.1,28.2 18.2,28.3 19,28.3 v19.5,29.1
RX_EN  (via drill 0.33)
  Top 0.222: U2.55 | U2.55 20.7,27.1 v20.8,27.2
  Bottom 0.22: 22.77,29.27 22.77,40.23
  Bottom 0.222: 22.77,29.27 v20.8,27.2 | 22.77,40.23 JP1.2
RX_RF/SDA  (via drill 0.33)
  Top 0.222: U2.54 21.2,26.7 21.5,27 21.5,27.7 21.9,28.1 v22.6,28.1
  Bottom 0.222: v22.6,28.1 23.5,29 23.5,40.96 23.31,40.96 JP1.3
SCLK_CTRL  (via drill 0.33)
  Top 0.222: U2.14 12.8,18.3 12,17.5 9,17.5 | 9,17.5 7.88,17.5 JP6.7 | 9,17.5 9.2,17.7 9.2,17.9 v9.7,18.4 | JP3.7 7.92,31.88 8.9,30.9 v8.9,26.8 | U4.7 14.65,31.75 v14.3,31.5
  Bottom 0.222: JP7.7 8.38,4.88 9,5.5 9,17 8,18 7.38,18 JP6.7 | v8.9,26.8 8.9,25.6 8.8,25.5 8.8,19.3 v9.7,18.4 | v14.3,31.5 8.4,31.5 7.92,31.88 JP3.7
TIME_ADC
  Top 0.222: U2.36 25.3,18.8 25.6,18.5 26,18.5 D1.C 27.95,17.7 C3.1
TIME_CHARGE
  Top 0.222: U2.33 25.1,17.3 26.1,16.3 D1.A
TX_RF/SCL  (via drill 0.33)
  Top 0.222: U2.46 25.7,23.8 26.6,24.7 26.6,25.3 v26.2,25.7 | U2.46
  Bottom 0.22: 24.04,41.13 24,41.09
  Bottom 0.222: 24,41.09 24,28.3 23,27.4 21.6,27.4 21.4,27.1 21.4,24 21.6,23.8 25.7,23.8 26.45,24.55 26.45,25.45 v26.2,25.7 | JP1.4 24.04,41.13
VCC  (via drill 0.33, 0.4)
  Top 0.222: U2.18 16.7,15.8 16.1,15.2 16.1,14.9 v15.9,14.7 | U2.48 24.7,24.8 v24.7,26.3 | v22.2,26.7 22.2,26.8 U2.52 | v16.7,26.7 U2.63 | v21.8,33.7 21.98,33.7 U9.3 24.34,34.58 C13.1 | v21.5,31.2 20.34,31.2 U4.13 | R7.2 19.43,5.57 v19.4,5.3 | U2.35 25.2,18.3 v25.7,17.8
  pour Bottom: 5.5,-0.5 32,0 32.5,42.5 6,42.5
VIN  (via drill 0.33)
  Top 0.222: v29.5,24.5 29.5,24.8 29.7,25.1 30.9,25.1 JP4.1 | v17.53,36.37 17.1,36.8 16.4,36.8 U1.4 | 20.87,35.87 21.5,35.87 21.37,36 v19.5,36 | 25.3,36.3 v25.5,36.5 24.87,35.87 U9.4 | JP8.1 29.4,13.1 24.9,13.1 v24.5,13.5 | v27,6 27.5,6.5 27.5,7.4 27.3,7.6 25.98,7.6 U3.1
  Top 0.333: U9.1 21.5,35.87 U9.4
  Bottom 0.222: v25.5,36.5 27.5,36.5 29.25,38.25 | v17.53,36.37 19.37,35.87 v19.5,36 | JP8.1 29.5,13 29.5,16.11 v29.5,24.5 29.6,24.9 30.6,25.9 30.6,28 29.5,29 29.5,30.88 29.5,32.5 29,33 29,35 29.7,35.7 29.7,37.8 29.25,38.25 | 29.25,38.25 29.5,38.5 JP2.1 | v24.5,13.5 25.2,12.8 25.2,6.7 25.9,6 v27,6

### Text on the board
Dimension: CUT OUT | CUT OUT
tPlace: Harvester | Harvester | Peripheral 1 | Peripheral 2 | Peripheral 3 | Mayfly Hardware Platform Rev. B / Computation Board
bPlace: Mayfly Hardware Platform Rev. B / Josiah Hester / PERSIST Lab / Clemson University